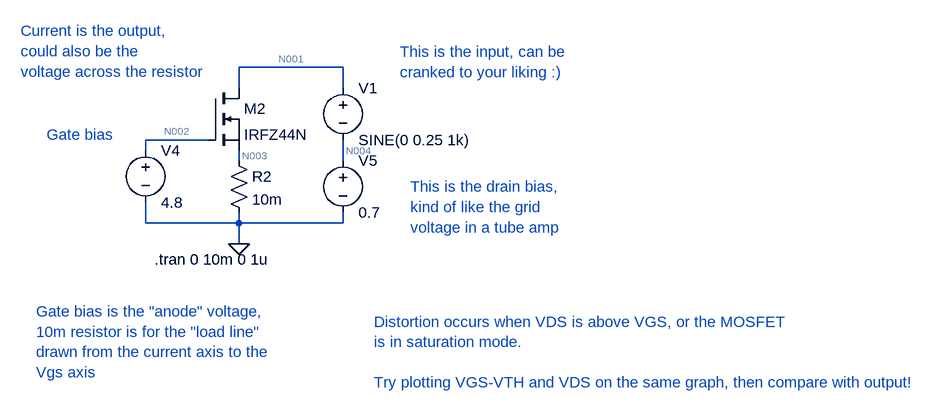
[diagram p0: schematic Test.asc]
Test.asc, the LTspice schematic file:
Version 4
SHEET 1 2308 740
WIRE 1360 112 1200 112
WIRE 1200 144 1200 112
WIRE 1360 144 1360 112
WIRE 1152 224 1056 224
WIRE 1056 240 1056 224
WIRE 1200 256 1200 240
WIRE 1360 256 1360 224
WIRE 1056 352 1056 320
WIRE 1200 352 1200 336
WIRE 1200 352 1056 352
WIRE 1360 352 1360 336
WIRE 1360 352 1200 352
WIRE 1200 384 1200 352
FLAG 1200 384 0
SYMBOL nmos 1152 144 R0
SYMATTR InstName M2
SYMATTR Value IRFZ44N
SYMBOL voltage 1056 224 R0
WINDOW 123 0 0 Left 0
WINDOW 39 0 0 Left 0
SYMATTR InstName V4
SYMATTR Value 4.8
SYMBOL voltage 1360 240 R0
WINDOW 123 0 0 Left 0
WINDOW 39 0 0 Left 0
SYMATTR InstName V5
SYMATTR Value 0.7
SYMBOL res 1184 240 R0
SYMATTR InstName R2
SYMATTR Value 10m
SYMBOL voltage 1360 128 R0
WINDOW 123 0 0 Left 0
WINDOW 39 0 0 Left 0
SYMATTR InstName V1
SYMATTR Value SINE(0 0.25 1k)
TEXT 1070 408 Left 2 !.tran 0 10m 0 1u
TEXT 1464 296 Left 2 ;This is the drain bias,\nkind of like the grid\nvoltage in a tube amp
TEXT 1448 88 Left 2 ;This is the input, can be\ncranked to your liking :)
TEXT 864 56 Left 2 ;Current is the output,\ncould also be the \nvoltage across the resistor
TEXT 904 216 Left 2 ;Gate bias
TEXT 888 488 Left 2 ;Gate bias is the "anode" voltage,\n10m resistor is for the "load line"\ndrawn from the current axis to the\nVgs axis
TEXT 1408 504 Left 2 ;Distortion occurs when VDS is above VGS, or the MOSFET\nis in saturation mode.\n \nTry plotting VGS-VTH and VDS on the same graph, then compare with output!

The netlist it stands for:
* Test.asc
M2 N001 N002 N003 N003 IRFZ44N
V4 N002 0 4.8
V5 N004 0 0.7
R2 N003 0 10m
V1 N001 N004 SINE(0 0.25 1k)
.model NMOS NMOS
.model PMOS PMOS
.lib standard.mos
.tran 0 10m 0 1u
* This is the drain bias,
* kind of like the grid
* voltage in a tube amp
* This is the input, can be
* cranked to your liking :)
* Current is the output,
* could also be the
* voltage across the resistor
* Gate bias
* Gate bias is the "anode" voltage,
* 10m resistor is for the "load line"
* drawn from the current axis to the
* Vgs axis
* Distortion occurs when VDS is above VGS, or the MOSFET
* is in saturation mode.
* Try plotting VGS-VTH and VDS on the same graph, then compare with output!
.backanno
.end

* Results of the author's LTspice run, read from the files saved beside the schematic
* Operating Point, zero values left out:
*   V(n001) = 700 mV
*   V(n002) = 4.8 V
*   V(n003) = 51.7 mV
*   V(n004) = 700 mV
*   Id(M2) = 5.17 A
*   Is(M2) = -5.17 A
*   I(R2) = 5.17 A
*   I(V1) = -5.17 A
*   I(V5) = -5.17 A
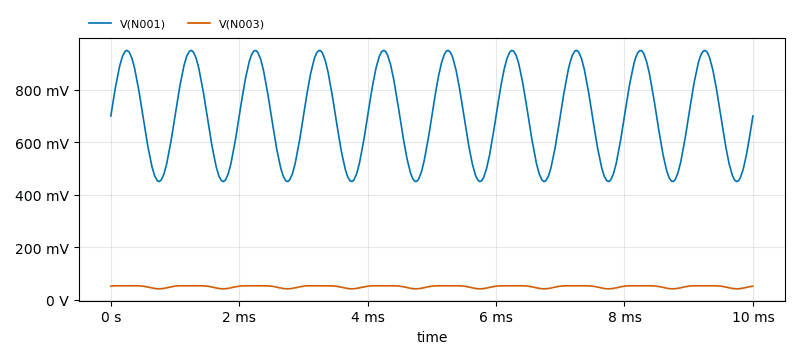
[diagram p1: Transient Analysis of Test.asc, plotted from the saved traces]
* Transient Analysis, 1 run:
*   V(N001): min 450.1 mV, max 950 mV, average 700 mV, rms 722.3 mV, last 700 mV
*   V(N003): min 41.59 mV, max 53.03 mV, average 49.37 mV, rms 49.55 mV, last 51.7 mV